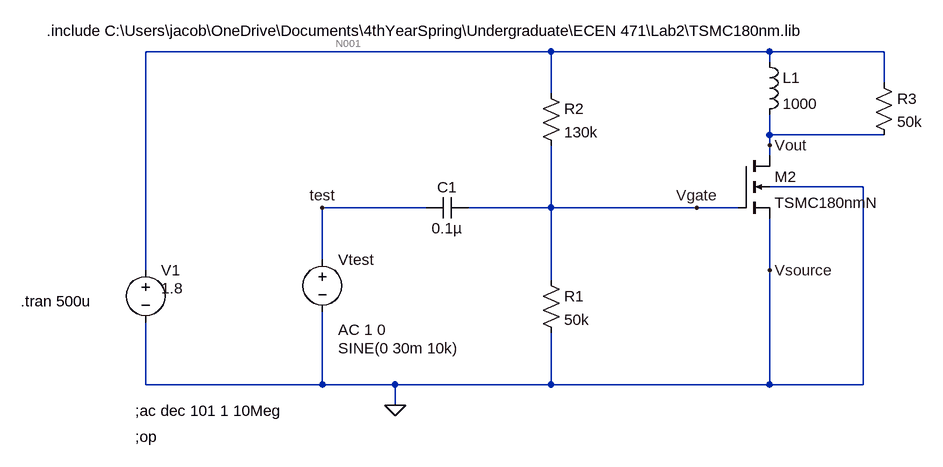
[diagram p0: schematic Draft2.asc]
Draft2.asc, the LTspice schematic file:
Version 4
SHEET 1 1464 808
WIRE 656 96 32 96
WIRE 992 96 656 96
WIRE 1168 96 992 96
WIRE 992 112 992 96
WIRE 1168 144 1168 96
WIRE 656 160 656 96
WIRE 992 224 992 192
WIRE 1168 224 992 224
WIRE 992 240 992 224
WIRE 992 256 992 240
WIRE 1136 304 992 304
WIRE 464 336 304 336
WIRE 656 336 656 240
WIRE 656 336 528 336
WIRE 880 336 656 336
WIRE 944 336 880 336
WIRE 304 416 304 336
WIRE 32 432 32 96
WIRE 992 432 992 352
WIRE 656 448 656 336
WIRE 32 608 32 512
WIRE 304 608 304 496
WIRE 304 608 32 608
WIRE 416 608 304 608
WIRE 656 608 656 528
WIRE 656 608 416 608
WIRE 992 608 992 432
WIRE 992 608 656 608
WIRE 1136 608 1136 304
WIRE 1136 608 992 608
WIRE 416 640 416 608
FLAG 416 640 0
FLAG 992 240 Vout
FLAG 880 336 Vgate
FLAG 992 432 Vsource
FLAG 304 336 test
SYMBOL nmos4 944 256 R0
SYMATTR InstName M2
SYMATTR Value TSMC180nmN
SYMATTR Value2 l=360n w=100u
SYMBOL voltage 32 416 R0
WINDOW 3 24 44 Left 2
WINDOW 123 0 0 Left 0
WINDOW 39 0 0 Left 0
SYMATTR InstName V1
SYMATTR Value 1.8
SYMBOL voltage 304 400 R0
WINDOW 3 24 152 Left 2
WINDOW 123 24 124 Left 2
WINDOW 39 0 0 Left 0
SYMATTR InstName Vtest
SYMATTR Value SINE(0 30m 10k)
SYMATTR Value2 AC 1 0
SYMBOL cap 528 320 R90
WINDOW 0 0 32 VBottom 2
WINDOW 3 32 32 VTop 2
SYMATTR InstName C1
SYMATTR Value 0.1µ
SYMBOL res 640 432 R0
SYMATTR InstName R1
SYMATTR Value 50k
SYMBOL res 640 144 R0
SYMATTR InstName R2
SYMATTR Value 130k
SYMBOL ind 976 96 R0
SYMATTR InstName L1
SYMATTR Value 1000
SYMBOL res 1152 128 R0
SYMATTR InstName R3
SYMATTR Value 50k
TEXT -120 64 Left 2 !.include C:\\Users\\jacob\\OneDrive\\Documents\\4thYearSpring\\Undergraduate\\ECEN 471\\Lab2\\TSMC180nm.lib
TEXT 16 688 Left 2 !;op
TEXT 16 648 Left 2 !;ac dec 101 1 10Meg
TEXT -160 480 Left 2 !.tran 500u

The netlist it stands for:
* Draft2.asc
M2 Vout Vgate 0 0 TSMC180nmN l=360n w=100u
V1 N001 0 1.8
Vtest test 0 SINE(0 30m 10k) AC 1 0
C1 Vgate test 0.1µ
R1 Vgate 0 50k
R2 N001 Vgate 130k
L1 N001 Vout 1000
R3 N001 Vout 50k
.model NMOS NMOS
.model PMOS PMOS
.lib standard.mos
.include C:\Users\jacob\OneDrive\Documents\4thYearSpring\Undergraduate\ECEN 471\Lab2\TSMC180nm.lib
;op
;ac dec 101 1 10Meg
.tran 500u
.backanno
.end

* Results of the author's LTspice run, read from the files saved beside the schematic
* Operating Point, zero values left out:
*   V(vout) = 1.8 V
*   V(vgate) = 500 mV
*   V(n001) = 1.8 V
*   Id(M2) = 86.63 µA
*   Ib(M2) = -1.81 pA
*   Is(M2) = -86.63 µA
*   I(L1) = 86.63 µA
*   I(R3) = 1.733 pA
*   I(R2) = 10 µA
*   I(R1) = 10 µA
*   I(V1) = -96.63 µA
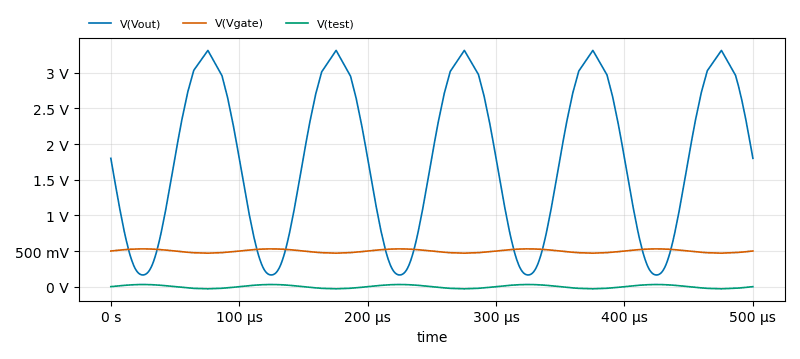
[diagram p1: Transient Analysis of Draft2.asc, plotted from the saved traces]
* Transient Analysis, 1 run:
*   V(Vout): min 163.8 mV, max 3.314 V, average 1.754 V, rms 2.081 V, last 1.8 V
*   V(Vgate): min 469.9 mV, max 529.9 mV, average 500.1 mV, rms 500.6 mV, last 500 mV
*   V(test): min -29.96 mV, max 30 mV, average 260.7 µV, rms 20.97 mV, last 0 V